# EAGLE schematic pneuBoard (EAGLE 6.6.0)
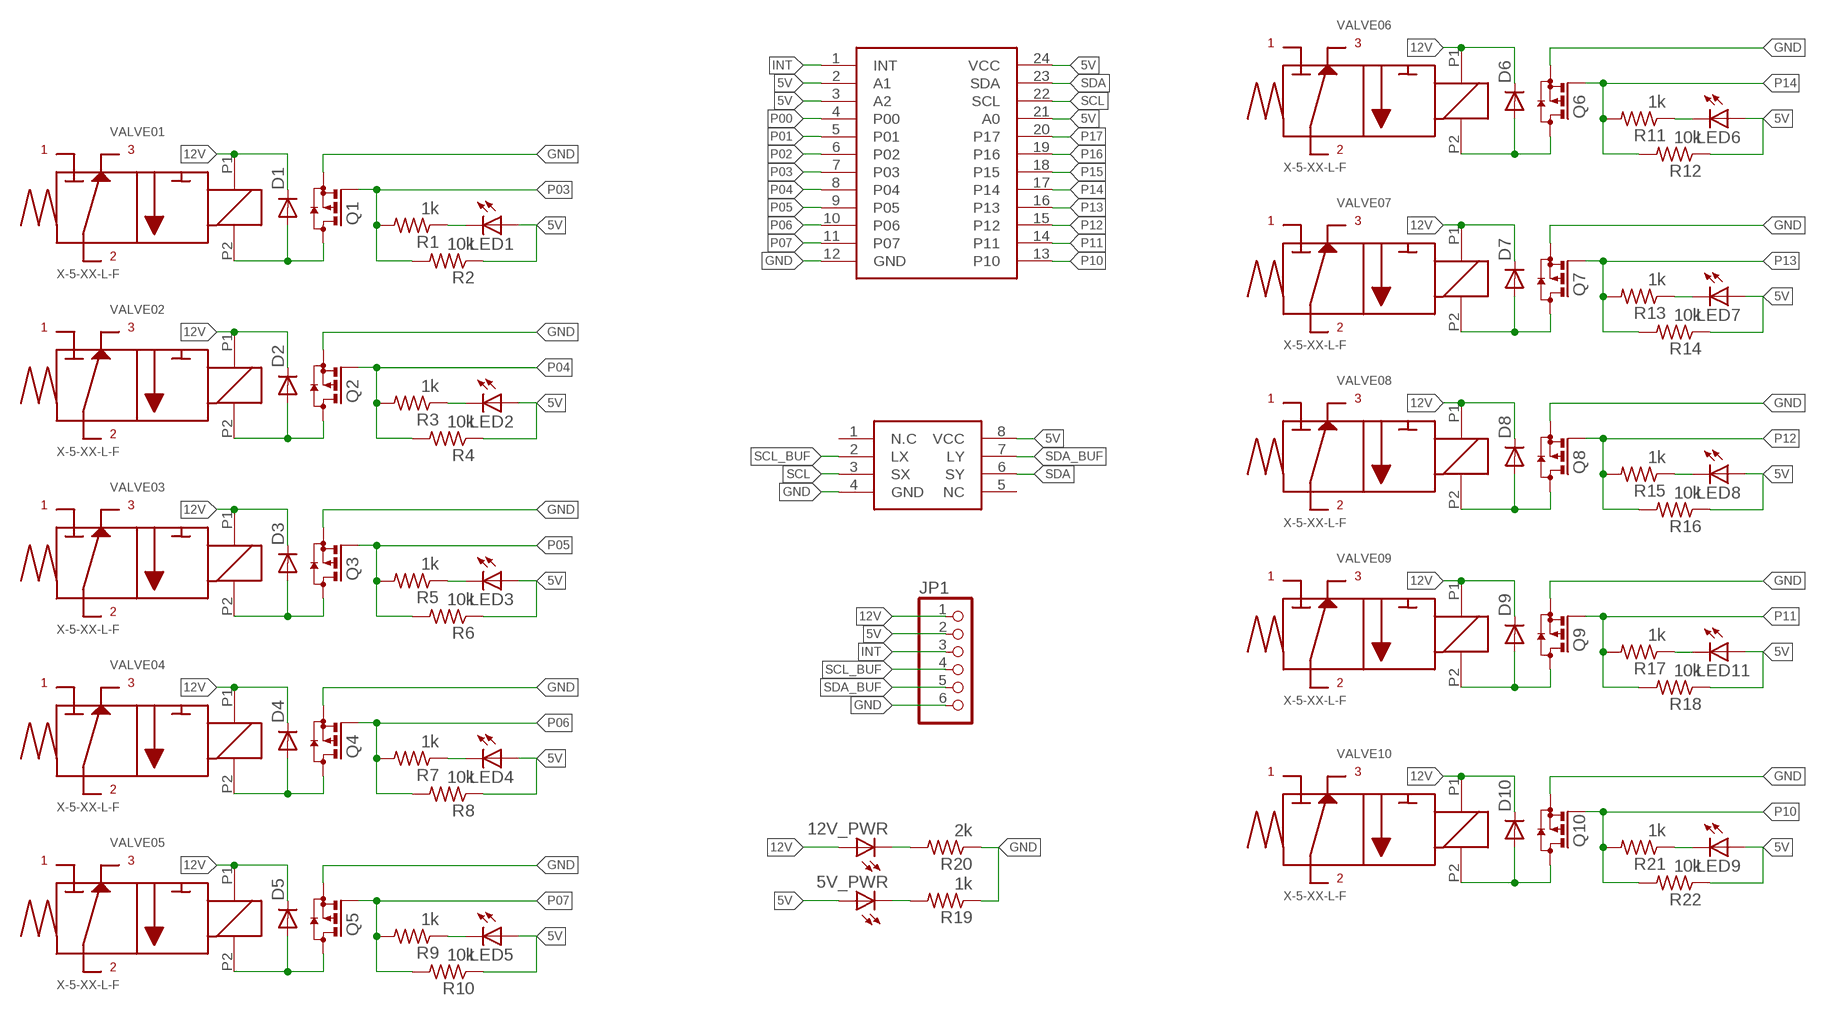
[diagram p0: schematic, sheet 1]

## Parts
5V_PWR  LEDSML1206  [SML1206]
12V_PWR  LEDSML1206  [SML1206]
D1  DIODE-SOD123  [SOD123]
D2  DIODE-SOD123  [SOD123]
D3  DIODE-SOD123  [SOD123]
D4  DIODE-SOD123  [SOD123]
D5  DIODE-SOD123  [SOD123]
D6  DIODE-SOD123  [SOD123]
D7  DIODE-SOD123  [SOD123]
D8  DIODE-SOD123  [SOD123]
D9  DIODE-SOD123  [SOD123]
D10  DIODE-SOD123  [SOD123]
JP1  PINHD-1X6/90  [1X06/90]
LED1  LEDSML1206  [SML1206]
LED2  LEDSML1206  [SML1206]
LED3  LEDSML1206  [SML1206]
LED4  LEDSML1206  [SML1206]
LED5  LEDSML1206  [SML1206]
LED6  LEDSML1206  [SML1206]
LED7  LEDSML1206  [SML1206]
LED8  LEDSML1206  [SML1206]
LED9  LEDSML1206  [SML1206]
LED11  LEDSML1206  [SML1206]
Q1  BSS84  [SOT23]
Q2  BSS84  [SOT23]
Q3  BSS84  [SOT23]
Q4  BSS84  [SOT23]
Q5  BSS84  [SOT23]
Q6  BSS84  [SOT23]
Q7  BSS84  [SOT23]
Q8  BSS84  [SOT23]
Q9  BSS84  [SOT23]
Q10  BSS84  [SOT23]
R1  1k  R-US_R0603  [R0603]
R2  10k  R-US_R0603  [R0603]
R3  1k  R-US_R0603  [R0603]
R4  10k  R-US_R0603  [R0603]
R5  1k  R-US_R0603  [R0603]
R6  10k  R-US_R0603  [R0603]
R7  1k  R-US_R0603  [R0603]
R8  10k  R-US_R0603  [R0603]
R9  1k  R-US_R0603  [R0603]
R10  10k  R-US_R0603  [R0603]
R11  1k  R-US_R0603  [R0603]
R12  10k  R-US_R0603  [R0603]
R13  1k  R-US_R0603  [R0603]
R14  10k  R-US_R0603  [R0603]
R15  1k  R-US_R0603  [R0603]
R16  10k  R-US_R0603  [R0603]
R17  1k  R-US_R0603  [R0603]
R18  10k  R-US_R0603  [R0603]
R19  1k  R-US_R0603  [R0603]
R20  2k  R-US_R0603  [R0603]
R21  1k  R-US_R0603  [R0603]
R22  10k  R-US_R0603  [R0603]
U$1  PCF8575C  [PW_R-PDSO-G24]
U$2  P82B715  [SO8]
VALVE01  X-5-XX-L-F  [X-SERIES]
VALVE02  X-5-XX-L-F  [X-SERIES]
VALVE03  X-5-XX-L-F  [X-SERIES]
VALVE04  X-5-XX-L-F  [X-SERIES]
VALVE05  X-5-XX-L-F  [X-SERIES]
VALVE06  X-5-XX-L-F  [X-SERIES]
VALVE07  X-5-XX-L-F  [X-SERIES]
VALVE08  X-5-XX-L-F  [X-SERIES]
VALVE09  X-5-XX-L-F  [X-SERIES]
VALVE10  X-5-XX-L-F  [X-SERIES]

## Nets
5V: 5V_PWR.A JP1.2 LED1.A LED2.A LED3.A LED4.A LED5.A LED6.A LED7.A LED8.A LED9.A LED11.A R2.1 R4.1 R6.1 R8.1 R10.1 R12.1 R14.1 R16.1 R18.1 R22.1 U$1.2(A1) U$1.3(A2) U$1.21(A0) U$1.24(VCC) U$2.8(VCC)
5V_LED: 5V_PWR.C R19.2
12V: 12V_PWR.A D1.C D2.C D3.C D4.C D5.C D6.C D7.C D8.C D9.C D10.C JP1.1 VALVE01.P1 VALVE02.P1 VALVE03.P1 VALVE04.P1 VALVE05.P1 VALVE06.P1 VALVE07.P1 VALVE08.P1 VALVE09.P1 VALVE10.P1
12V_PWR: 12V_PWR.C R20.2
GND: JP1.6 Q1.2(S) Q2.2(S) Q3.2(S) Q4.2(S) Q5.2(S) Q6.2(S) Q7.2(S) Q8.2(S) Q9.2(S) Q10.2(S) R19.1 R20.1 U$1.12(GND) U$2.4(GND)
INT: JP1.3 U$1.1(INT)
N$1: D2.A Q2.3(D) VALVE02.P2
N$2: LED1.C R1.1
N$3: LED2.C R3.1
N$4: D3.A Q3.3(D) VALVE03.P2
N$5: LED3.C R5.1
N$6: D1.A Q1.3(D) VALVE01.P2
N$7: D4.A Q4.3(D) VALVE04.P2
N$8: LED4.C R7.1
N$9: D5.A Q5.3(D) VALVE05.P2
N$10: LED5.C R9.1
N$11: D6.A Q6.3(D) VALVE06.P2
N$12: LED6.C R11.1
N$13: D7.A Q7.3(D) VALVE07.P2
N$14: LED7.C R13.1
N$15: D8.A Q8.3(D) VALVE08.P2
N$16: LED8.C R15.1
N$17: D9.A Q9.3(D) VALVE09.P2
N$18: LED11.C R17.1
N$19: D10.A Q10.3(D) VALVE10.P2
N$20: LED9.C R21.1
P00: U$1.4(P00)
P01: U$1.5(P01)
P02: U$1.6(P02)
P03: Q1.1(G) R1.2 R2.2 U$1.7(P03)
P04: Q2.1(G) R3.2 R4.2 U$1.8(P04)
P05: Q3.1(G) R5.2 R6.2 U$1.9(P05)
P06: Q4.1(G) R7.2 R8.2 U$1.10(P06)
P07: Q5.1(G) R9.2 R10.2 U$1.11(P07)
P10: Q10.1(G) R21.2 R22.2 U$1.13(P10)
P11: Q9.1(G) R17.2 R18.2 U$1.14(P11)
P12: Q8.1(G) R15.2 R16.2 U$1.15(P12)
P13: Q7.1(G) R13.2 R14.2 U$1.16(P13)
P14: Q6.1(G) R11.2 R12.2 U$1.17(P14)
P15: U$1.18(P15)
P16: U$1.19(P16)
P17: U$1.20(P17)
SCL: U$1.22(SCL) U$2.3(SX)
SCL_BUF: JP1.4 U$2.2(LX)
SDA: U$1.23(SDA) U$2.6(SY)
SDA_BUF: JP1.5 U$2.7(LY)
Unconnected: U$2.1(N.C) U$2.5(NC)

## Library data of the parts
5V_PWR 12V_PWR LED1-LED9 LED11 = led:LED: LED OSRAM: - CHIPLED LG R971, LG N971, LY N971, LG Q971, LY Q971, LO R971, LY R971 LH N974, LH R974 LS Q976, LO Q976, LY Q976 LO Q996 - Hyper CHIPLED LW Q18S LB Q993, LB Q99A, LB R99A - SideLED LS A670, LO A670, LY A670, LG A670, LP A670 LB A673, LV A673, LT A673, LW A673 LH A674 LY A675 LS A676, LA A676, LO A676, LY A676, LW A676 LS A679, LY A679, LG A679 - Hyper Micro SIDELED® LS Y876, LA Y876, LO Y876, LY Y876 LT Y87S - SmartLED LW L88C, LW L88S LB L89C, LB L89S, LG L890 LS L89K, LO L89K, LY L89K LS L896, LA L896, LO L896, LY L896 - TOPLED LS T670, LO T670, LY T670, LG T670, LP T670 LSG T670, LSP T670, LSY T670, LOP T670, LYG T670 LG T671, LOG T671, LSG T671 LB T673, LV T673, LT T673, LW T673 LH T674 LS T676, LA T676, LO T676, LY T676, LB T676, LH T676, LSB T676, LW T676 LB T67C, LV T67C, LT T67C, LS T67K, LO T67K, LY T67K, LW E67C LS E67B, LA E67B, LO E67B, LY E67B, LB E67C, LV E67C, LT E67C LW T67C LS T679, LY T679, LG T679 LS T770, LO T770, LY T770, LG T770, LP T770 LB T773, LV T773, LT T773, LW T773 LH T774 LS E675, LA E675, LY E675, LS T675 LS T776, LA T776, LO T776, LY T776, LB T776 LHGB T686 LT T68C, LB T68C - Hyper Mini TOPLED® LB M676 - Mini TOPLED Santana® LG M470 LS M47K, LO M47K, LY M47K Source: http://www.osram.convergy.de LUXEON: - LUMILED® LXK2-PW12-R00, LXK2-PW12-S00, LXK2-PW14-U00, LXK2-PW14-V00 LXK2-PM12-R00, LXK2-PM12-S00, LXK2-PM14-U00 LXK2-PE12-Q00, LXK2-PE12-R00, LXK2-PE12-S00, LXK2-PE14-T00, LXK2-PE14-U00 LXK2-PB12-K00, LXK2-PB12-L00, LXK2-PB12-M00, LXK2-PB14-N00, LXK2-PB14-P00, LXK2-PB14-Q00 LXK2-PR12-L00, LXK2-PR12-M00, LXK2-PR14-Q00, LXK2-PR14-R00 LXK2-PD12-Q00, LXK2-PD12-R00, LXK2-PD12-S00 LXK2-PH12-R00, LXK2-PH12-S00 LXK2-PL12-P00, LXK2-PL12-Q00, LXK2-PL12-R00 Source: www.luxeon.com KINGBRIGHT: KA-3528ASYC Source: www.kingbright.com
D1-D10 = diode:DIODE-: DIODE
JP1 = pinhead:PINHD-1X6: PIN HEADER
Q1-Q10 = transistor-small-signal:BSS84: P-CHANNEL MOS FET
R1-R22 = resistor:R-US_: RESISTOR, American symbol
U$1 = texas:PCF8575C: Remote 16 Bit I2C IO Expander
U$2 = nxp:P82B715
VALVE01-VALVE09 VALVE10 = ParkerFludics:X-5-XX-L-F